# EAGLE design basestation_nbiot (EAGLE 9.6.2)
COMPONENTS: Arduino-NB-IoT; DESCRIPTION: Basismodul; DRAWING_VERSION: 1.0; DRAWN: Tobias Poppe; FIRMA: Tobias Poppe; PRINTDATE: 30.01.2023; PROJECT: Open-WaLeS; STATUS: Prod.
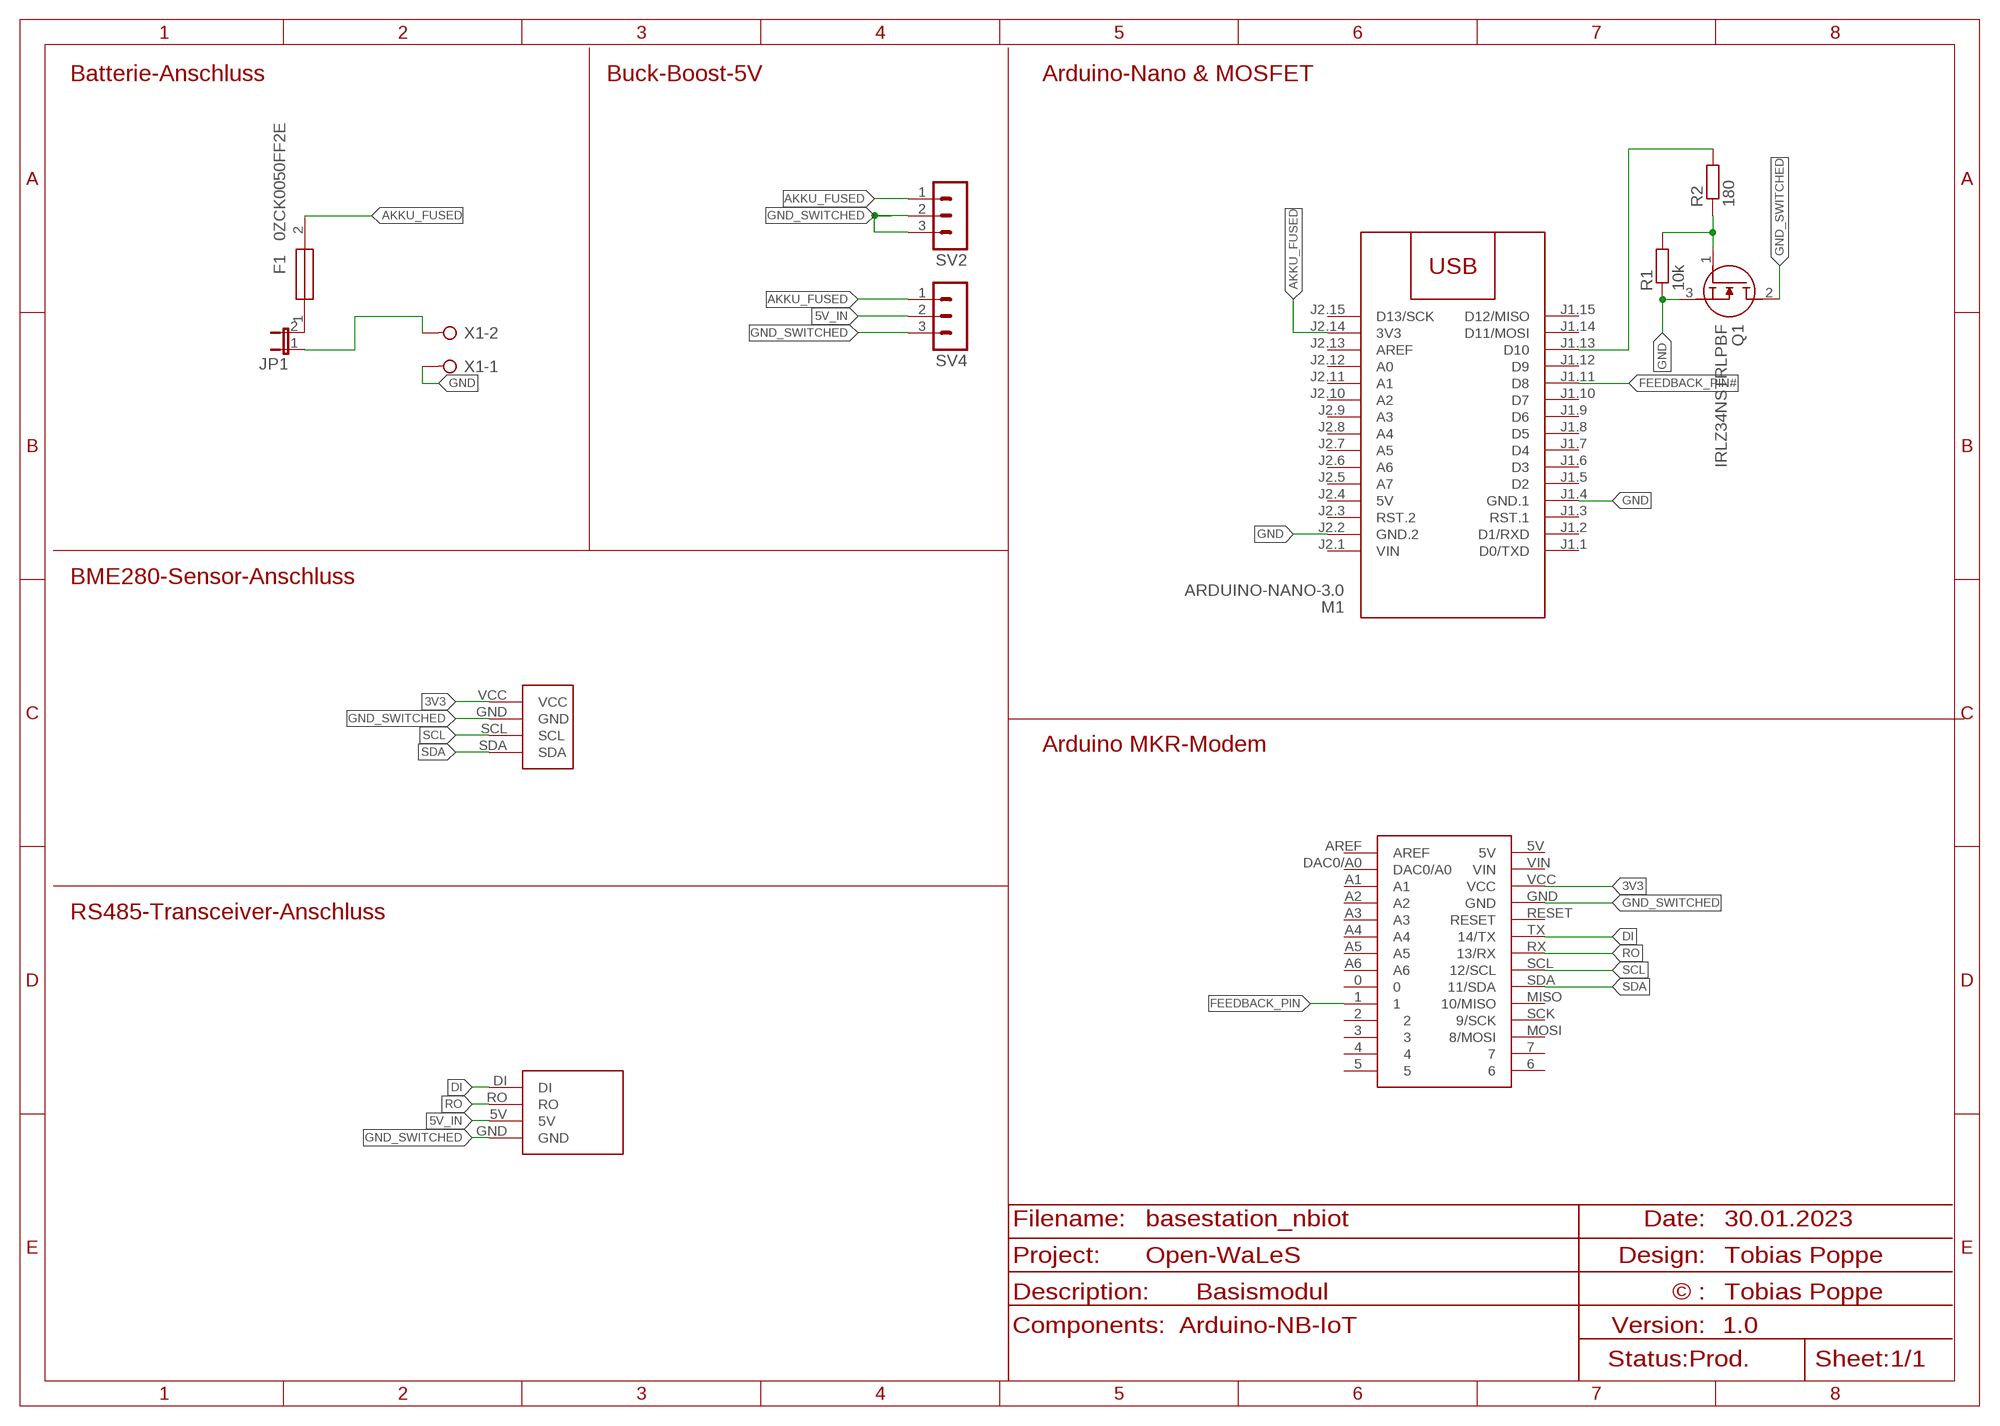
[diagram p0: schematic, sheet 1]

## Parts
F1  0ZCK0050FF2E  [FUSC2214X125N]
JP1  JP1E  [JP1]
M1  ARDUINO-NANO-3.0  [ARDUINO-NANO-3.0]
Q1  IRLZ34NSTRLPBF  [D2PAK]
R1  10k  R-EU_R1206  [R1206]
R2  180  R-EU_R1206  [R1206]
SV2  MA03-1  [MA03-1]
SV4  MA03-1  [MA03-1]
U$1  ARDUINO_GSM_MKR_1400  [ARDUINO_GSM_MKR1400]
U$2  BME280-BREAKOUT  [BME280-BREAKOUT]
U$3  RS485_PEGEL_BREAKOUT  [RS485_PEGEL_BREAKOUT]
X1  W237-02P  [W237-132]

## Nets
3V3: U$1.VCC U$2.VCC
5V_IN: SV4.2 U$3.5V
AKKU_FUSED: F1.2 M1.J2.14(3V3) SV2.1 SV4.1
AKKU_UNFUSED: JP1.1 X1.2
DI: U$1.TX(14/TX) U$3.DI
FEEDBACK_PIN: U$1.1
FEEDBACK_PIN#: M1.J1.11(D8)
GND: M1.J1.4(GND.1) M1.J2.2(GND.2) Q1.3(S) R1.1 X1.1
GND_SWITCHED: Q1.2(D) SV2.2 SV2.3 SV4.3 U$1.GND U$2.GND U$3.GND
N$1: M1.J1.13(D10) R2.2
N$2: Q1.1(G) R1.2 R2.1
N$3: F1.1 JP1.2
RO: U$1.RX(13/RX) U$3.RO
SCL: U$1.SCL(12/SCL) U$2.SCL
SDA: U$1.SDA(11/SDA) U$2.SDA
Unconnected: M1.J1.1(D0/TXD) M1.J1.2(D1/RXD) M1.J1.3(RST.1) M1.J1.5(D2) M1.J1.6(D3) M1.J1.7(D4) M1.J1.8(D5) M1.J1.9(D6) M1.J1.10(D7) M1.J1.12(D9) M1.J1.14(D11/MOSI) M1.J1.15(D12/MISO) M1.J2.3(RST.2) M1.J2.5(A7) M1.J2.6(A6) M1.J2.7(A5) M1.J2.8(A4) M1.J2.9(A3) M1.J2.10(A2) M1.J2.11(A1) M1.J2.12(A0) M1.J2.13(AREF) M1.J2.15(D13/SCK) U$1.0 U$1.2(⁓2) U$1.3(⁓3) U$1.4(⁓4) U$1.5(⁓5) U$1.5V U$1.6 U$1.7 U$1.A1 U$1.A2 U$1.A3 U$1.A4 U$1.A5 U$1.A6 U$1.AREF U$1.DAC0/A0 U$1.MISO(10/MISO) U$1.MOSI(8/MOSI) U$1.RESET U$1.SCK(9/SCK) U$1.VIN

## Notes on the sheet
- Batterie-Anschluss | Buck-Boost-5V | Arduino-Nano & MOSFET
- BME280-Sensor-Anschluss
- Arduino MKR-Modem
- RS485-Transceiver-Anschluss

## Power pins joined to a net without a drawn wire
5V: M1.J2.4(5V)
VIN: M1.J2.1(VIN)

## Library data of the parts
F1 = samacsys:0ZCK0050FF2E: BEL FUSE - CIRCUIT PROTECTION - 0ZCK0050FF2E - Resettable Fuse, PPTC, 0805 (2012 Metric), 0ZCK Series, 6 VDC, 500 mA, 1 A, 0.1 s Source: Datasheet <https://eagle.componentsearchengine.com/Datasheets/2/0ZCK0050FF2E.pdf>; ARROW_PART_NUMBER: 0ZCK0050FF2E; ARROW_PRICE-STOCK: https://www.arrow.com/en/products/0zck0050ff2e/bel-group?region=nac; DESCRIPTION: BEL FUSE - CIRCUIT PROTECTION - 0ZCK0050FF2E - Resettable Fuse, PPTC, 0805 (2012 Metric), 0ZCK Series, 6 VDC, 500 mA, 1 A, 0.1 s; HEIGHT: 1.25mm; MANUFACTURER_NAME: Bel Circuit Protection; MANUFACTURER_PART_NUMBER: 0ZCK0050FF2E
JP1 = jumper:JP1E: JUMPER
M1 = diy-modules:ARDUINO-NANO-3.0: Arduino Nano 3.0
Q1 = samacsys:IRLZ34NSTRLPBF: MOSFET N-Channel HEXFET 55V 30A D2PAK Infineon IRLZ34NSTRLPBF N-channel MOSFET Transistor, 30 A, 55 V, 3+Tab-Pin D2PAK Source: Datasheet <https://www.infineon.com/dgdl/irlz34nspbf.pdf?fileId=5546d462533600a40153567210152722>; ARROW_PART_NUMBER: IRLZ34NSTRLPBF; ARROW_PRICE-STOCK: https://www.arrow.com/en/products/irlz34nstrlpbf/infineon-technologies-ag; DESCRIPTION: MOSFET N-Channel HEXFET 55V 30A D2PAK Infineon IRLZ34NSTRLPBF N-channel MOSFET Transistor, 30 A, 55 V, 3+Tab-Pin D2PAK; HEIGHT: mm; MANUFACTURER_NAME: Infineon; MANUFACTURER_PART_NUMBER: IRLZ34NSTRLPBF; MOUSER_PART_NUMBER: 942-IRLZ34NSTRLPBF; MOUSER_PRICE-STOCK: https://www.mouser.co.uk/ProductDetail/Infineon-IR/IRLZ34NSTRLPBF?qs=9%252BKlkBgLFf3%2F7oYCM5eA2g%3D%3D
R1 R2 = rcl:R-EU_: RESISTOR, European symbol; SPICEPREFIX: R
SV2 SV4 = con-lstb:MA03-1: PIN HEADER; OC_FARNELL: unknown; OC_NEWARK: unknown
U$1 = topo-eng:ARDUINO_GSM_MKR_1400
U$2 = topo-eng:BME280-BREAKOUT
U$3 = topo-eng:RS485_PEGEL_BREAKOUT
X1 = con-wago-508:W237-02P: WAGO SREW CLAMP; OC_FARNELL: unknown; OC_NEWARK: unknown

## Board
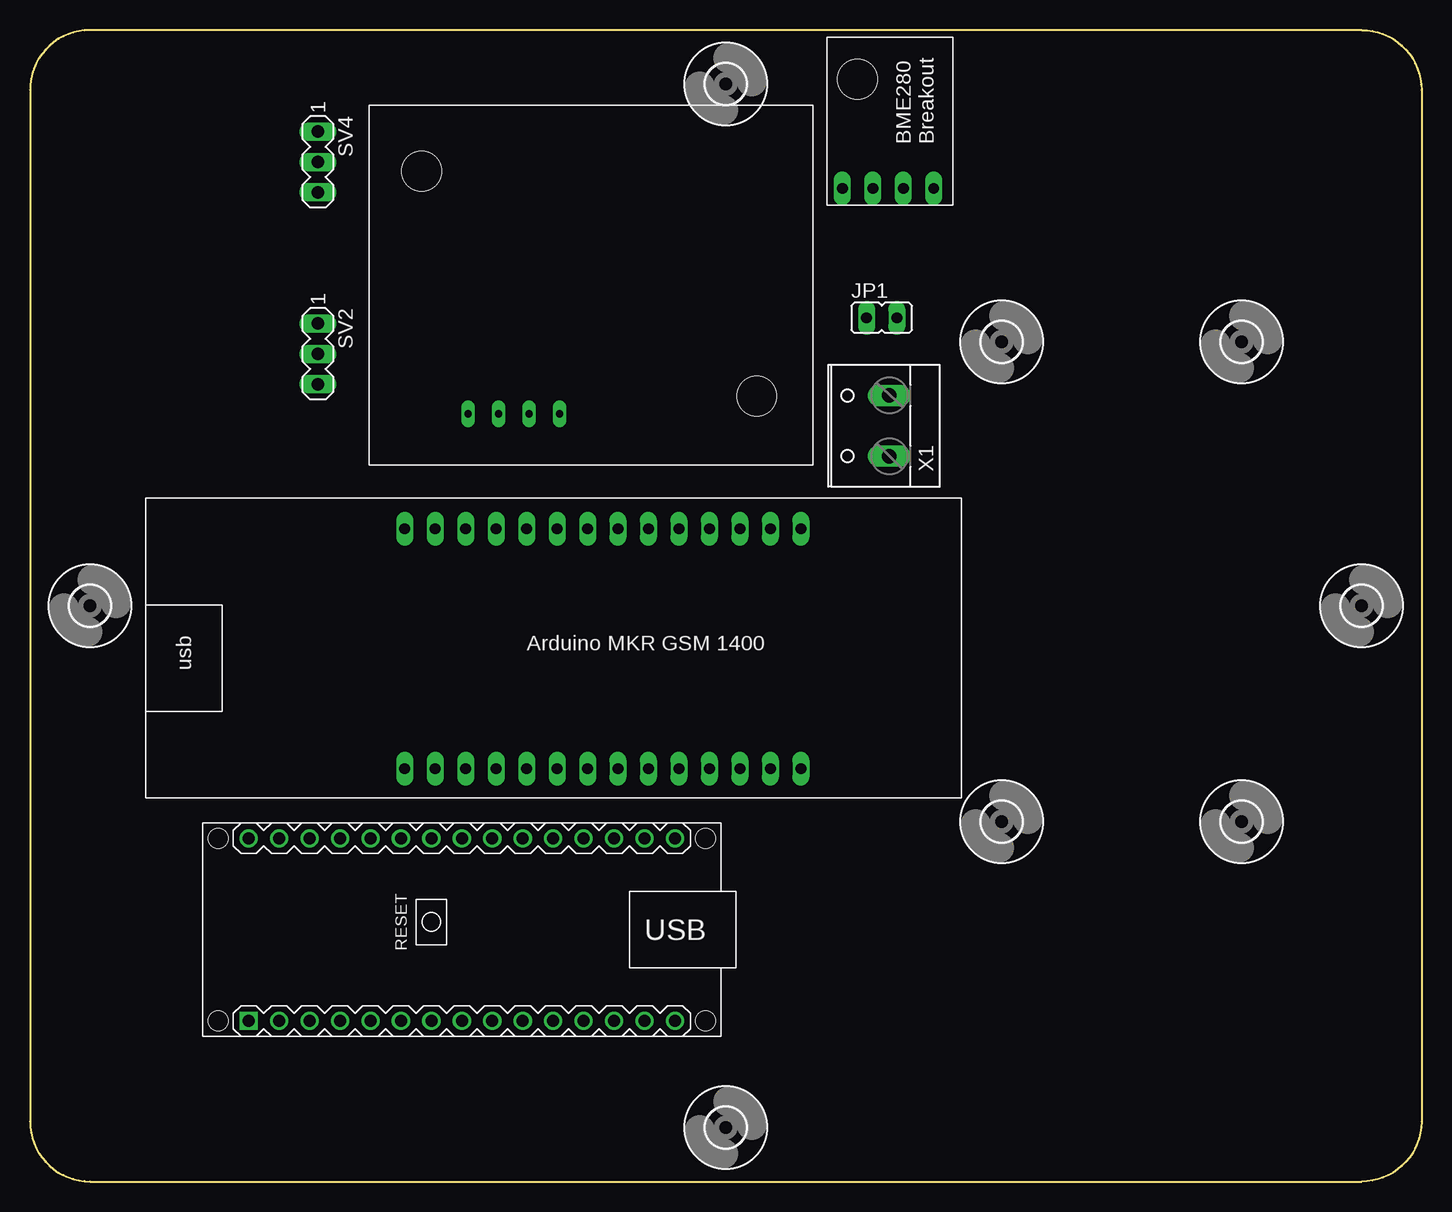
[diagram p1: board, top side]
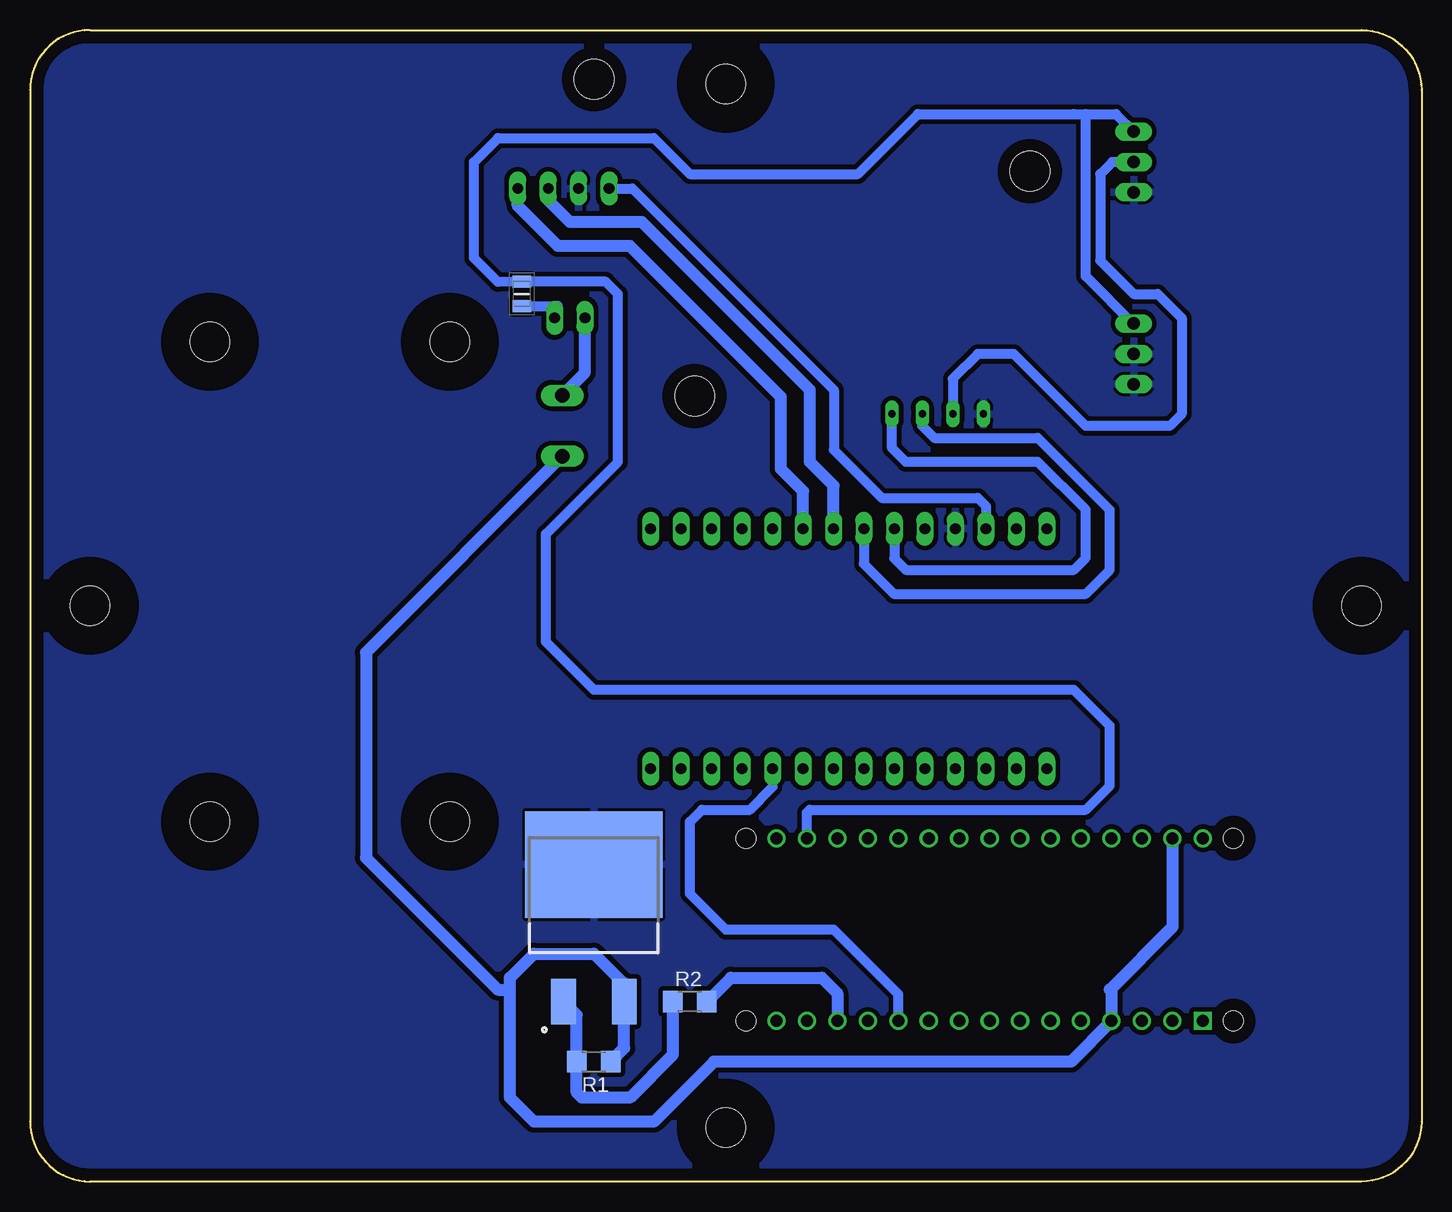
[diagram p2: board, bottom side, seen from below]

Size 116 x 96 mm. Coordinates in mm from the lower left corner, seen from the top.
Outline: 0,91 0,5 arc90 5,0 111,0 arc90 116,5 116,91 arc90 111,96 5,96 arc90 0,91
Copper layers (1*16): Top 0.035mm / dielectric 1.5mm / Bottom 0.035mm
Design rules "default *": minimum track width 6mil, minimum drill 0.35mm, track to track 0.4mm, track to pad 0.4mm, pad to pad 0.4mm, via to via 0.4mm, smd to smd 0.4mm, copper to edge 40mil, drill to drill 6mil, minimum pad ring 10mil, minimum via ring 8mil, stop-mask expansion 4mil, vias tented up to drill 0mil, thermal gap 10mil

### Footprints (pad centres in the part's own frame; a part is rotated, then mirrored left to right if it is on the bottom)
FUSC2214X125N = smd 1 x 1.52: 1 -1.01,0; 2 1.01,0
JP1 = drill 0.914 long: 1 0,-1.27; 2 0,1.27
ARDUINO-NANO-3.0 = drill 1 square: J1.1 17.78,7.62 | drill 1: J1.2 15.24,7.62; J1.3 12.7,7.62; J1.4 10.16,7.62; J1.5 7.62,7.62; J1.6 5.08,7.62; J1.7 2.54,7.62; J1.8 0,7.62; J1.9 -2.54,7.62; J1.10 -5.08,7.62; J1.11 -7.62,7.62; J1.12 -10.16,7.62; J1.13 -12.7,7.62; J1.14 -15.24,7.62; J1.15 -17.78,7.62; J2.1 17.78,-7.62; J2.2 15.24,-7.62; J2.3 12.7,-7.62; J2.4 10.16,-7.62; J2.5 7.62,-7.62; J2.6 5.08,-7.62; J2.7 2.54,-7.62; J2.8 0,-7.62; J2.9 -2.54,-7.62; J2.10 -5.08,-7.62; J2.11 -7.62,-7.62; J2.12 -10.16,-7.62; J2.13 -12.7,-7.62; J2.14 -15.24,-7.62; J2.15 -17.78,-7.62 | hole 1.651: -20.32,7.62; -20.32,-7.62; 20.32,-7.62; 20.32,7.62
D2PAK = smd 2.08 x 3.81: 1 -2.54,0; 3 2.54,0 | smd 11.43 x 8.89: 2 0,11.43
R1206 = smd 1.6 x 1.803: 1 -1.422,0; 2 1.422,0
MA03-1 = drill 1.016 long: 1 -2.54,0; 2 0,0; 3 2.54,0
ARDUINO_GSM_MKR1400 = drill 0.9 long: 0 22.54,41.91; 1 22.54,44.45; 2 22.54,46.99; 3 22.54,49.53; 4 22.54,52.07; 5 22.54,54.61; 5V 2.54,21.59; 6 2.54,54.61; 7 2.54,52.07; A1 22.54,26.67; A2 22.54,29.21; A3 22.54,31.75; A4 22.54,34.29; A5 22.54,36.83; A6 22.54,39.37; AREF 22.54,21.59; DAC0/A0 22.54,24.13; GND 2.54,29.21; MISO 2.54,44.45; MOSI 2.54,49.53; RESET 2.54,31.75; RX 2.54,36.83; SCK 2.54,46.99; SCL 2.54,39.37; SDA 2.54,41.91; TX 2.54,34.29; VCC 2.54,26.67; VIN 2.54,24.13
BME280-BREAKOUT = drill 0.9 long: GND 3.81,1.4; SCL 6.35,1.4; SDA 8.89,1.4; VCC 1.27,1.4 | hole 3.3: 2.54,10.5
RS485_PEGEL_BREAKOUT = drill 0.6 long: 5V 25.718,10.795; DI 25.718,15.875; GND 25.718,8.255; RO 25.718,13.335 | hole 3.3: 5.49,4.378; 24.223,32.32
3,3 = hole 3.3: 0,0
W237-132 = drill 1.194 long: 1 -2.54,-0.635; 2 2.54,-0.635

### Placement (x,y rotation side)
F1  75,74 90 bottom
JP1  71,72 270 top
M1  36,21 180 top
Q1  69,15 0 bottom
R1  69,10 180 bottom
R2  61,15 0 bottom
SV2  24,69 270 top
SV4  24,85 270 top
U$1  9.65,56.96 270 top
U$2  66.45,81.39 0 top
U$3  28.27,89.71 270 top
U$4  [3,3]  58,91.5 0 top
U$5  [3,3]  58,4.5 0 top
U$6  [3,3]  111,48 0 top
U$7  [3,3]  81,70 0 top
U$8  [3,3]  101,70 0 top
U$9  [3,3]  81,30 0 top
U$12  [3,3]  101,30 0 top
U$13  [3,3]  5,48 0 top
X1  71,63 90 top

### Tracks (layer width: path | path; a pad name or v marks a point on that pad's centre or on a via)
3V3
  Bottom 0.813: U$2.VCC 65.79,82.79 49,66 49,61 45,57 37,57 36.32,56.32 U$1.VCC
5V_IN
  Bottom 0.813: SV4.2 25.79,85 26.79,84 26.79,76.79 24,74 22,74 20,72 20,64 21,63 28,63 34,69 37,69 39.06,66.94 U$3.5V
AKKU_FUSED
  Bottom 0.813: SV4.1 25.46,89 28,89 | 28,89 29,89 42,89 47,84 61,84 64,87 77,87 79,85 79,77 77,75 F1.2 68.01,75.01 67,74 67,60 73,54 73,45 69,41 29,41 26,38 26,33 28,31 51,31 51.24,30.76 M1.J2.14 | SV2.1 24.03,71.49 28,75.46 28,89
AKKU_UNFUSED
  Bottom 1.016: X1.2 69.73,67.44 JP1.1
DI
  Bottom 0.813: U$1.TX 43.94,51.94 43,51 29,51 28,52 28,56.02 31.98,60 43,60 44.14,61.15 U$3.DI
FEEDBACK_PIN#
  Bottom 0.813: M1.J1.11 43.62,15.62 49,21 58,21 61,24 61,30 60,31 56,31 54.1,32.9
GND
  Bottom 1.016: R1.1 66.46,11.12 Q1.3 | Q1.3 66.46,16.54 | M1.J2.2 20.76,21.24 26,16 25.84,15.84 M1.J1.4 29.22,10 59,10 64,5 74,5 76,7 76,16 | Q1.3 66.46,16.46 69,19 74,19 76,17 76,16 | X1.1 88,44.09 88,27 77,16 76,16
GND_SWITCHED
  pour Bottom: -4,99 120,99 120,-4 -4,-4
N$1
  Bottom 1.016: R2.2 57.58,17 50,17 48.7,15.7 M1.J1.13
N$2
  Bottom 1.016: R2.1 62.42,10.58 66,7 70,7 70.42,7.42 R1.2 70.42,13.88 Q1.1
N$3
  Bottom 0.813: JP1.2 72.27,73 71.99,73 72,72.99 F1.1
RO
  Bottom 0.813: U$1.RX 46.48,51.48 44,49 28,49 26,51 26,56 31.99,61.99 40.61,61.99 41.61,62.99 U$3.RO
SCL
  Bottom 1.016: U$1.SCL 49.02,58.02 51,60 51,66 65,80 71,80 72.8,81.8 U$2.SCL
SDA
  Bottom 1.016: U$1.SDA 51.56,57.56 53.42,59.42 53.42,65.42 66,78 72,78 75.34,81.34 U$2.SDA